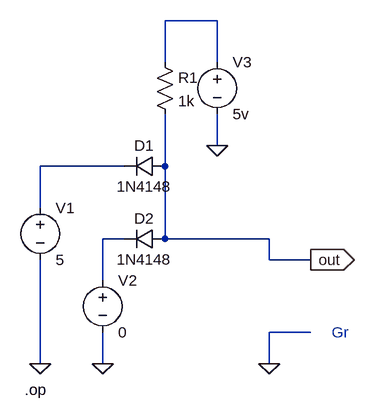
[diagram p0: schematic and.asc]
and.asc, the LTspice schematic file:
Version 4
SHEET 1 880 680
WIRE 96 -432 16 -432
WIRE 16 -368 16 -432
WIRE 96 -368 96 -432
WIRE 96 -240 96 -288
WIRE -48 -208 -176 -208
WIRE 16 -208 16 -288
WIRE -176 -144 -176 -208
WIRE -48 -96 -80 -96
WIRE 16 -96 16 -208
WIRE 176 -96 16 -96
WIRE 176 -64 176 -96
WIRE 240 -64 176 -64
WIRE -80 -32 -80 -96
WIRE 240 48 176 48
WIRE -176 96 -176 -64
WIRE -80 96 -80 48
WIRE 176 96 176 48
FLAG -176 96 0
FLAG -80 96 0
FLAG 96 -240 0
FLAG 240 -64 out
IOPIN 240 -64 Out
FLAG 176 96 0
DATAFLAG 256 -64 ""
DATAFLAG 208 -64 ""
SYMBOL diode 16 -224 R90
WINDOW 0 0 32 VBottom 2
WINDOW 3 32 32 VTop 2
SYMATTR InstName D1
SYMATTR Value 1N4148
SYMBOL diode 16 -112 R90
WINDOW 0 0 32 VBottom 2
WINDOW 3 32 32 VTop 2
SYMATTR InstName D2
SYMATTR Value 1N4148
SYMBOL voltage -80 -48 R0
WINDOW 123 0 0 Left 0
WINDOW 39 0 0 Left 0
SYMATTR InstName V2
SYMATTR Value 0
SYMBOL voltage -176 -160 R0
WINDOW 123 0 0 Left 0
WINDOW 39 0 0 Left 0
SYMATTR InstName V1
SYMATTR Value 5
SYMBOL res 0 -384 R0
SYMATTR InstName R1
SYMATTR Value 1k
SYMBOL voltage 96 -384 R0
WINDOW 123 0 0 Left 0
WINDOW 39 0 0 Left 0
SYMATTR InstName V3
SYMATTR Value 5v
TEXT -200 136 Left 2 !.op
TEXT 272 48 Left 2 ;Gr

The netlist it stands for:
* and.asc
D1 out N002 1N4148
D2 out N003 1N4148
V2 N003 0 0
V1 N002 0 5
R1 N001 out 1k
V3 N001 0 5v
.model D D
.lib standard.dio
.op
* Gr
.backanno
.end